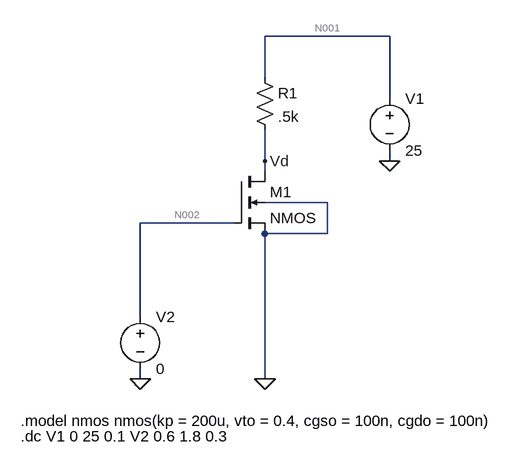
[diagram p0: schematic DC characteristics.asc]
DC characteristics.asc, the LTspice schematic file:
Version 4
SHEET 1 880 680
WIRE 432 -112 240 -112
WIRE 240 -48 240 -112
WIRE 432 -16 432 -112
WIRE 240 80 240 32
WIRE 432 80 432 64
WIRE 240 96 240 80
WIRE 336 144 240 144
WIRE 192 176 48 176
WIRE 336 192 336 144
WIRE 336 192 240 192
WIRE 48 320 48 176
WIRE 48 416 48 400
WIRE 240 416 240 192
FLAG 432 80 0
FLAG 48 416 0
FLAG 240 416 0
FLAG 240 80 Vd
SYMBOL nmos4 192 96 R0
SYMATTR InstName M1
SYMATTR Value2 l=1u w=250u
SYMBOL voltage 432 -32 R0
WINDOW 123 0 0 Left 0
WINDOW 39 0 0 Left 0
SYMATTR InstName V1
SYMATTR Value 25
SYMBOL voltage 48 304 R0
WINDOW 123 0 0 Left 0
WINDOW 39 0 0 Left 0
SYMATTR InstName V2
SYMATTR Value 0
SYMBOL res 224 -64 R0
SYMATTR InstName R1
SYMATTR Value .5k
TEXT -136 480 Left 2 !.model nmos nmos(kp = 200u, vto = 0.4, cgso = 100n, cgdo = 100n)
TEXT -136 504 Left 2 !.dc V1 0 25 0.1 V2 0.6 1.8 0.3

The netlist it stands for:
* DC characteristics.asc
M1 Vd N002 0 0 NMOS l=1u w=250u
V1 N001 0 25
V2 N002 0 0
R1 N001 Vd .5k
.model NMOS NMOS
.model PMOS PMOS
.lib standard.mos
.model nmos nmos(kp = 200u, vto = 0.4, cgso = 100n, cgdo = 100n)
.dc V1 0 25 0.1 V2 0.6 1.8 0.3
.backanno
.end

* Results of the author's LTspice run, read from the files saved beside the schematic
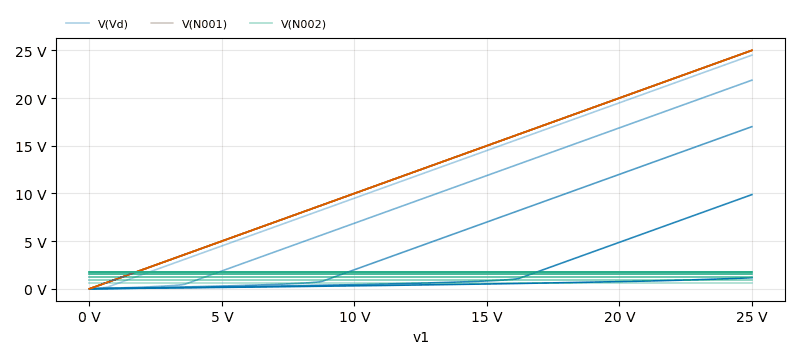
[diagram p1: DC transfer characteristic of DC characteristics.asc, plotted from the saved traces]
* DC transfer characteristic, 5 runs:
*   V(Vd) [v2=0.6]: -5.208e-08 fV at v1=0 V, 24.5 V at v1=25 V, min -5.208e-08 fV, max 24.5 V
*   V(Vd) [v2=0.9]: -2.315e-08 fV at v1=0 V, 21.88 V at v1=25 V, min -2.315e-08 fV, max 21.88 V
*   V(Vd) [v2=1.2]: -1.488e-08 fV at v1=0 V, 17 V at v1=25 V, min -1.488e-08 fV, max 17 V
*   V(Vd) [v2=1.5]: -1.096e-08 fV at v1=0 V, 9.875 V at v1=25 V, min -1.096e-08 fV, max 9.875 V
*   V(Vd) [v2=1.8]: -8.68e-09 fV at v1=0 V, 1.169 V at v1=25 V, min -8.68e-09 fV, max 1.169 V
*   V(N001) [v2=0.6]: 0 V at v1=0 V, 25 V at v1=25 V, min 0 V, max 25 V
*   V(N001) [v2=0.9]: 0 V at v1=0 V, 25 V at v1=25 V, min 0 V, max 25 V
*   V(N001) [v2=1.2]: 0 V at v1=0 V, 25 V at v1=25 V, min 0 V, max 25 V
*   V(N001) [v2=1.5]: 0 V at v1=0 V, 25 V at v1=25 V, min 0 V, max 25 V
*   V(N001) [v2=1.8]: 0 V at v1=0 V, 25 V at v1=25 V, min 0 V, max 25 V
*   V(N002) [v2=0.6]: 600 mV at v1=0 V, 600 mV at v1=25 V, min 600 mV, max 600 mV
*   V(N002) [v2=0.9]: 900 mV at v1=0 V, 900 mV at v1=25 V, min 900 mV, max 900 mV
*   V(N002) [v2=1.2]: 1.2 V at v1=0 V, 1.2 V at v1=25 V, min 1.2 V, max 1.2 V
*   V(N002) [v2=1.5]: 1.5 V at v1=0 V, 1.5 V at v1=25 V, min 1.5 V, max 1.5 V
*   V(N002) [v2=1.8]: 1.8 V at v1=0 V, 1.8 V at v1=25 V, min 1.8 V, max 1.8 V